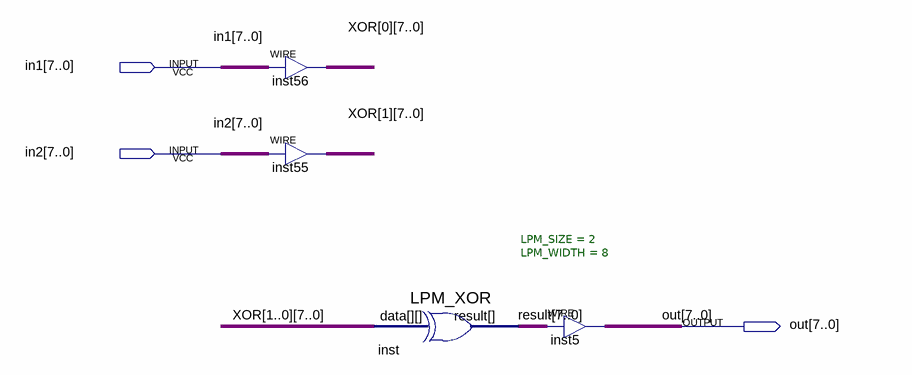
[diagram p0: schematic sheet]
// Quartus schematic xorb8.bdf as structural Verilog: 4 symbols, 3 pins
module xorb8 (
  input  [7:0] in1,
  input  [7:0] in2,
  output [7:0] out
);

  wire [7:0] result, XOR_0, XOR_1;

  assign XOR_0 = in1;  // WIRE inst56
  assign XOR_1 = in2;  // WIRE inst55
  LPM_XOR #(.LPM_SIZE(2), .LPM_WIDTH(8)) inst (.data({XOR_1, XOR_0}), .result(result));
  assign out = result;  // WIRE inst5
endmodule
